# EAGLE design untitled (EAGLE 7.1.0)
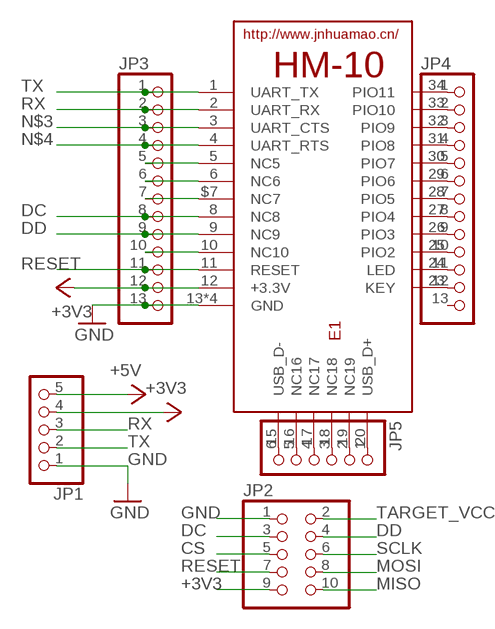
[diagram p0: schematic, sheet 1]

## Parts
E1  HM-10-BOARD  [26.9X13X2.2_BOARD]
JP1  PINHD-1X5  [1X05]
JP2  PINHD-2X5  [2X05]
JP3  PINHD-1X13  [1X13]
JP4  PINHD-1X13  [1X13]
JP5  PINHD-1X6  [1X06]

## Nets
+3V3: E1.12(+3.3V) JP1.4 JP2.9 JP3.12
+5V: JP1.5
CS: JP2.5
DC: E1.8(NC8) JP2.3 JP3.8
DD: E1.9(NC9) JP2.4 JP3.9
GND: E1.13(GND) E1.14(GND) E1.21(GND) E1.22(GND) JP1.1 JP2.1 JP3.13
MISO: JP2.10
MOSI: JP2.8
N$1: E1.5(NC5) JP3.5
N$2: E1.6(NC6) JP3.6
N$3: E1.3(UART_CTS) JP3.3
N$4: E1.4(UART_RTS) JP3.4
N$5: E1.$7(NC7) JP3.7
N$6: E1.10(NC10) JP3.10
N$7: E1.34(PIO11) JP4.1
N$8: E1.33(PIO10) JP4.2
N$9: E1.32(PIO9) JP4.3
N$10: E1.31(PIO8) JP4.4
N$11: E1.30(PIO7) JP4.5
N$12: E1.29(PIO6) JP4.6
N$13: E1.28(PIO5) JP4.7
N$14: E1.27(PIO4) JP4.8
N$15: E1.26(PIO3) JP4.9
N$16: E1.25(PIO2) JP4.10
N$17: E1.24(LED) JP4.11
N$18: E1.23(KEY) JP4.12
N$19: E1.20(USB_D+) JP5.1
N$20: E1.19(NC19) JP5.2
N$21: E1.18(NC18) JP5.3
N$22: E1.17(NC17) JP5.4
N$23: E1.16(NC16) JP5.5
N$24: E1.15(USB_D-) JP5.6
RESET: E1.11(RESET) JP2.7 JP3.11
RX: E1.2(UART_RX) JP1.3 JP3.2
SCLK: JP2.6
TARGET_VCC: JP2.2
TX: E1.1(UART_TX) JP1.2 JP3.1
Unconnected: JP4.13

## Library data of the parts
E1 = JNHuaMao:HM-10: HM Bluetooth module use TI CC2540 or CC2541, Master and slave roles in one, transmission version and remote control version and PIO state acquisition functions in one, Support the AT command modify module parameters, Convenient and flexible.
JP1 = pinhead:PINHD-1X5: PIN HEADER
JP2 = pinhead:PINHD-2X5: PIN HEADER
JP3 JP4 = pinhead:PINHD-1X13: PIN HEADER
JP5 = pinhead:PINHD-1X6: PIN HEADER

## Board
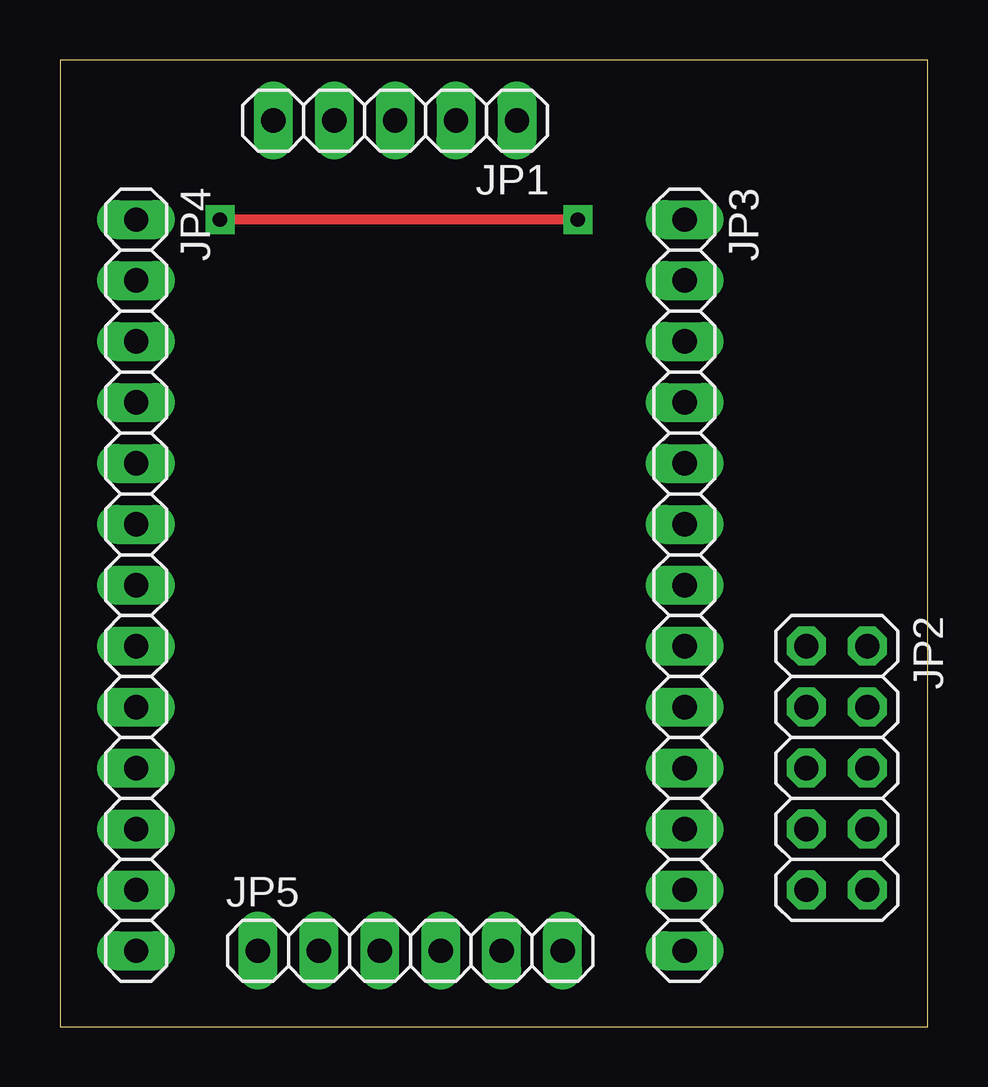
[diagram p1: board, top side]
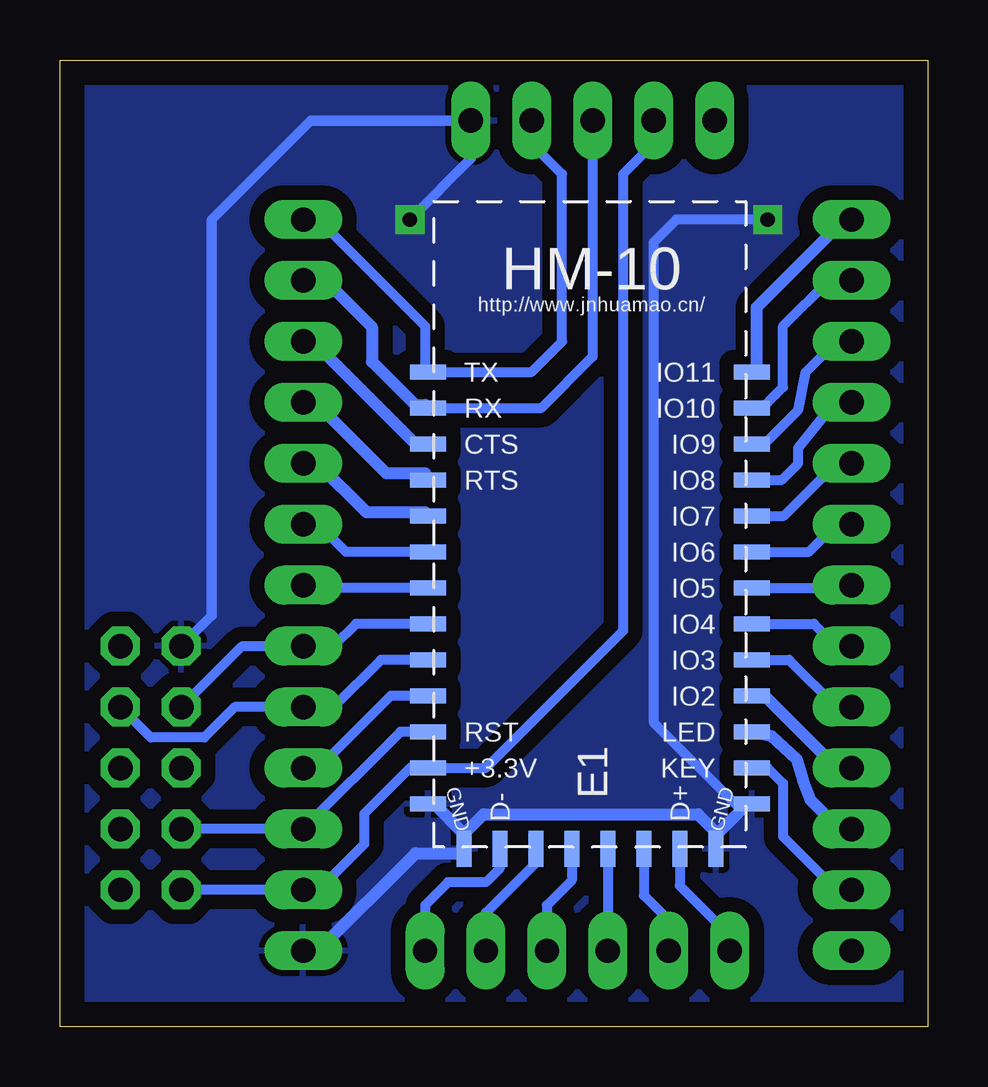
[diagram p2: board, bottom side, seen from below]

Size 36.17 x 40.31 mm. Coordinates in mm from the lower left corner, seen from the top.
Outline: 0,0 36.17,0 36.17,40.31 0,40.31 0,0
Copper layers (1*16): Top 0.035mm / dielectric 1.5mm / Bottom 0.035mm
Design rules "default": minimum track width 20mil, minimum drill 32mil, track to track 12mil, track to pad 12mil, pad to pad 12mil, via to via 12mil, smd to smd 12mil, copper to edge 40mil, drill to drill 40mil, minimum pad ring 12mil, minimum via ring 12mil, stop-mask expansion 4mil, vias tented up to drill 0mil, thermal gap 10mil

### Footprints (pad centres in the part's own frame; a part is rotated, then mirrored left to right if it is on the bottom)
26.9X13X2.2_BOARD = smd 1.5 x 0.635: 1 -7.5,0; 2 -7.5,-1.5; 3 -7.5,-3; 4 -7.5,-4.5; 5 -7.5,-6; 6 -7.5,-7.5; 8 -7.5,-10.5; 9 -7.5,-12; 10 -7.5,-13.5; 11 -7.5,-15; 12 -7.5,-16.5; 13 -7.5,-18; 22 6,-18; 23 6,-16.5; 24 6,-15; 25 6,-13.5; 26 6,-12; 27 6,-10.5; 28 6,-9; 29 6,-7.5; 30 6,-6; 31 6,-4.5; 32 6,-3; 33 6,-1.5; 34 6,0; $7 -7.5,-9 | smd 0.635 x 1.5: 14 -6,-19.875; 15 -4.5,-19.875; 16 -3,-19.875; 17 -1.5,-19.875; 18 0,-19.875; 19 1.5,-19.875; 20 3,-19.875; 21 4.5,-19.875
1X05 = drill 1.016 long: 1 -5.08,0; 2 -2.54,0; 3 0,0; 4 2.54,0; 5 5.08,0
2X05 = drill 1.016 octagon: 1 -5.08,-1.27; 2 -5.08,1.27; 3 -2.54,-1.27; 4 -2.54,1.27; 5 0,-1.27; 6 0,1.27; 7 2.54,-1.27; 8 2.54,1.27; 9 5.08,-1.27; 10 5.08,1.27
1X13 = drill 1.016 long: 1 -15.24,0; 2 -12.7,0; 3 -10.16,0; 4 -7.62,0; 5 -5.08,0; 6 -2.54,0; 7 0,0; 8 2.54,0; 9 5.08,0; 10 7.62,0; 11 10.16,0; 12 12.7,0; 13 15.24,0
1X06 = drill 1.016 long: 1 -6.35,0; 2 -3.81,0; 3 -1.27,0; 4 1.27,0; 5 3.81,0; 6 6.35,0

### Placement (x,y rotation side)
E1  13.34,27.3 0 bottom
JP1  13.97,37.78 180 top
JP2  32.38,10.79 270 top
JP3  26.04,18.41 270 top
JP4  3.17,18.41 270 top
JP5  14.61,3.17 0 top

### Tracks (layer width: path | path; a pad name or v marks a point on that pad's centre or on a via)
+3V3
  Bottom 0.406: JP1.4 11.43,36.83 12.7,35.56 12.7,16.51 18.41,10.8 E1.12 21.58,10.8 23.5,8.89 23.5,7.62 25.4,5.71 JP3.12 JP2.9
  Bottom 0.508: 31.11,5.51 JP2.9
DC
  Bottom 0.406: E1.8 23.84,16.8 24.77,15.88 JP3.8 28.57,15.88 JP2.3
  Bottom 0.508: 26.24,15.77 JP3.8
DD
  Bottom 0.406: E1.9 22.8,15.3 24.77,13.34 JP3.9 28.89,13.34 30.16,12.06 32.38,12.06 JP2.4
GND  (via drill 0.6)
  Top 0.406: v21.59,33.66 20,33.66 8.26,33.66 v6.67,33.66
  Bottom 0.406: JP1.1 25.72,37.78 | 25.72,37.78 29.84,33.66 | 29.84,33.66 29.84,17.14 | 29.84,17.14 JP2.1 | 29.84,17.14 29.84,33.66 | 29.84,33.66 25.72,37.78 | 25.72,37.78 19.37,37.78 19.05,38.1 JP1.1 | JP1.1 19.05,36.2 v21.59,33.66 | v6.67,33.66 10.48,33.66 11.43,32.7 11.43,12.7 7.77,9.04
  Bottom 0.508: 8.76,8.05 7.77,9.04 7.54,9.27 E1.22 | 8.76,8.05 8.76,7.64 E1.21 8.76,8.05 | 19.33,8.05 20.55,9.27 E1.13 | 19.33,8.05 19.33,7.64 E1.14 | E1.14 19.33,7.24 21.36,7.24 25.43,3.17 25.83,3.17 JP3.13 | 8.76,8.05 9.58,8.87 18.52,8.87 19.33,8.05 | 19.33,8.05 E1.14
  pour Bottom (isolate 0.61): 0,40.32 36.2,40.32 36.2,0 0,0
N$1
  Bottom 0.508: E1.5 20.95,21.46 23.39,21.46 25.43,23.5 25.83,23.5 JP3.5
N$2
  Bottom 0.406: E1.6 24.25,19.8 25.4,20.95 JP3.6
N$3
  Bottom 0.508: E1.3 20.95,24.31 21.36,24.31 25.83,28.78 JP3.3
N$4
  Bottom 0.508: E1.4 20.95,23.09 22.58,23.09 25.83,26.34 JP3.4
N$5
  Bottom 0.406: E1.$7 25.93,18.3 JP3.7
N$6
  Bottom 0.406: E1.10 22.39,13.8 25.4,10.79 JP3.10
N$7
  Bottom 0.508: E1.34 7.14,27.56 7.14,30 3.48,33.66 JP4.1
N$8
  Bottom 0.406: E1.33 6.9,25.8 6.35,26.35 6.03,26.67 6.03,29.21 4.13,31.11 JP4.2
N$9
  Bottom 0.406: E1.32 6.81,24.3 5.71,25.4 5.4,25.72 5.08,27.3 3.81,28.57 JP4.3
N$10
  Bottom 0.406: E1.31 6.09,22.8 5.4,23.5 5.4,24.13 4.13,25.72 3.49,25.72 JP4.4
N$11
  Bottom 0.406: E1.30 6,21.3 3.81,23.5 JP4.5
N$12
  Bottom 0.406: E1.29 4.96,19.8 3.81,20.95 JP4.6
N$13
  Bottom 0.406: E1.28 3.29,18.3 JP4.7
N$14
  Bottom 0.406: E1.27 4.74,16.8 3.81,15.88 JP4.8
N$15
  Bottom 0.406: E1.26 5.78,15.3 3.81,13.34 JP4.9
N$16
  Bottom 0.508: E1.25 7.14,13.74 6.73,13.74 3.48,10.49 JP4.10
N$17
  Bottom 0.508: E1.24 6.5,12.12 5.46,11.16 5.19,10.26 4.88,9.45 3.48,8.05 JP4.11
N$18
  Bottom 0.406: E1.23 6.68,10.8 6.03,10.16 6.03,7.94 3.81,5.71 JP4.12
N$19
  Bottom 0.406: E1.20 10.34,5.89 8.26,3.81 JP5.1
N$20
  Bottom 0.406: E1.19 11.84,5.49 10.79,4.45 JP5.2
N$21
  Bottom 0.406: E1.18 JP5.3
N$22
  Bottom 0.406: E1.17 14.84,6.12 15.88,5.08 JP5.4
N$23
  Bottom 0.406: E1.16 16.34,6.84 18.41,4.76 JP5.5
N$24
  Bottom 0.406: E1.15 17.84,6.61 18.41,6.03 20,6.03 20.95,5.08 JP5.6
RESET
  Bottom 0.406: E1.11 21.98,12.3 JP3.11 JP2.7
  Bottom 0.508: 31.11,7.95 JP2.7
RX
  Bottom 0.406: JP1.3 13.97,27.94 16.11,25.8 E1.2
  Bottom 0.508: E1.2 20.95,25.93 21.36,25.93 23.16,27.74 23.16,29.18 25.2,31.22 JP3.2
TX
  Bottom 0.406: JP1.2 16.51,36.83 15.24,35.56 15.24,28.57 16.51,27.3 E1.1 20.95,27.43 20.95,29.21 25.4,33.66 JP3.1